# Altium schematic sheet Raspberry_Pi_Card_Connector.SchDoc
size A4
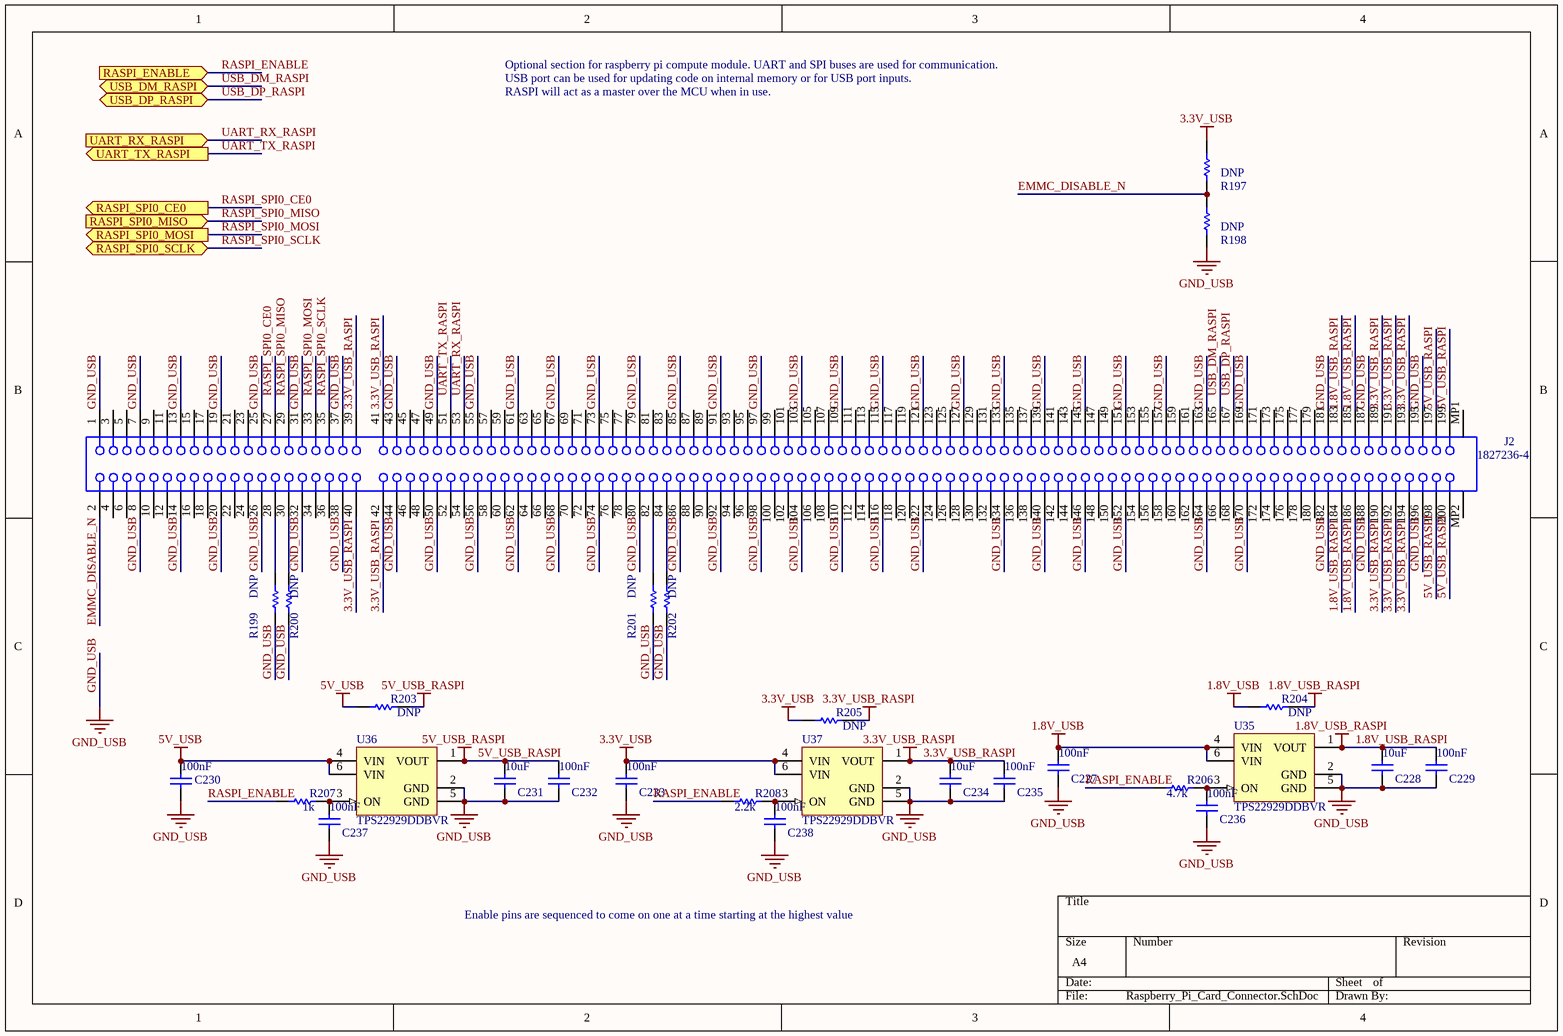
[diagram p0: Raspberry_Pi_Card_Connector.SchDoc]

## Parts
C227  value 100nF  [CAPC0402(1005)60_L]  (hidden comment: CAP0402)
C228  value 10uF  [CAPC0805(2012)145_L]  (hidden comment: CAP0805)
C229  value 100nF  [CAPC0402(1005)60_L]  (hidden comment: CAP0402)
C230  value 100nF  [CAPC0402(1005)60_L]  (hidden comment: CAP0402)
C231  value 10uF  [CAPC0805(2012)145_L]  (hidden comment: CAP0805)
C232  value 100nF  [CAPC0402(1005)60_L]  (hidden comment: CAP0402)
C233  value 100nF  [CAPC0402(1005)60_L]  (hidden comment: CAP0402)
C234  value 10uF  [CAPC0805(2012)145_L]  (hidden comment: CAP0805)
C235  value 100nF  [CAPC0402(1005)60_L]  (hidden comment: CAP0402)
C236  value 100nF  [CAPC0402(1005)60_L]  (hidden comment: CAP0402)
C237  value 100nF  [CAPC0402(1005)60_L]  (hidden comment: CAP0402)
C238  value 100nF  [CAPC0402(1005)60_L]  (hidden comment: CAP0402)
J2  1827236-4  [BTB-SM0-6-2V200]
R197  value DNP  [RESC0402(1005)_L]  (hidden comment: RES0402)
R198  value DNP  [RESC0402(1005)_L]  (hidden comment: RES0402)
R199  value DNP  [RESC0402(1005)_L]  (hidden comment: RES0402)
R200  value DNP  [RESC0402(1005)_L]  (hidden comment: RES0402)
R201  value DNP  [RESC0402(1005)_L]  (hidden comment: RES0402)
R202  value DNP  [RESC0402(1005)_L]  (hidden comment: RES0402)
R203  value DNP  [RESC0402(1005)_L]  (hidden comment: RES0402)
R204  value DNP  [RESC0402(1005)_L]  (hidden comment: RES0402)
R205  value DNP  [RESC0402(1005)_L]  (hidden comment: RES0402)
R206  value 4.7k  [RESC0402(1005)_L]  (hidden comment: RES0402)
R207  value 1k  [RESC0402(1005)_L]  (hidden comment: RES0402)
R208  value 2.2k  [RESC0402(1005)_L]  (hidden comment: RES0402)
U35  TPS22929DDBVR  [DBV6_N]
U36  TPS22929DDBVR  [DBV6_N]
U37  TPS22929DDBVR  [DBV6_N]

## Ports
RASPI_ENABLE (in), RASPI_SPI0_CE0 (out), RASPI_SPI0_MISO (in), RASPI_SPI0_MOSI (out), RASPI_SPI0_SCLK (bidir), UART_RX_RASPI (in), UART_TX_RASPI (out), USB_DM_RASPI (bidir), USB_DP_RASPI (bidir)

## Nets
1.8V_USB: C227.1 R204.2 U35.4(VIN) U35.6(VIN)
1.8V_USB_RASPI: C228.2 C229.1 J2.183 J2.184 J2.185 J2.186 R204.1 U35.1(VOUT)
3.3V_USB: C233.1 R197.1 R205.2 U37.4(VIN) U37.6(VIN)
3.3V_USB_RASPI: C234.2 C235.1 J2.39 J2.40 J2.41 J2.42 J2.189 J2.190 J2.191 J2.192 J2.193 J2.194 R205.1 U37.1(VOUT)
5V_USB: C230.1 R203.2 U36.4(VIN) U36.6(VIN)
5V_USB_RASPI: C231.2 C232.1 J2.197 J2.198 J2.199 J2.200 R203.1 U36.1(VOUT)
GND_USB: C227.2 C228.1 C229.2 C230.2 C231.1 C232.2 C233.2 C234.1 C235.2 C236.2 C237.2 C238.2 J2.1 J2.7 J2.8 J2.13 J2.14 J2.19 J2.20 J2.25 J2.26 J2.31 J2.32 J2.37 J2.38 J2.43 J2.44 J2.49 J2.50 J2.55 J2.56 J2.61 J2.62 J2.67 J2.68 J2.73 J2.74 J2.79 J2.80 J2.85 J2.86 J2.91 J2.92 J2.97 J2.98 J2.103 J2.104 J2.109 J2.110 J2.115 J2.116 J2.121 J2.122 J2.127 J2.133 J2.134 J2.139 J2.140 J2.145 J2.146 J2.151 J2.152 J2.157 J2.163 J2.164 J2.169 J2.170 J2.181 J2.182 J2.187 J2.188 J2.195 J2.196 R198.2 R199.2 R200.2 R201.2 R202.2 U35.2(GND) U35.5(GND) U36.2(GND) U36.5(GND) U37.2(GND) U37.5(GND)
EMMC_DISABLE_N: J2.2 R197.2 R198.1
RASPI_ENABLE: R206.2 R207.2 R208.2 ; port RASPI_ENABLE
RASPI_SPI0_CE0: J2.27 ; port RASPI_SPI0_CE0
RASPI_SPI0_MISO: J2.29 ; port RASPI_SPI0_MISO
RASPI_SPI0_MOSI: J2.33 ; port RASPI_SPI0_MOSI
RASPI_SPI0_SCLK: J2.35 ; port RASPI_SPI0_SCLK
UART_RX_RASPI: J2.53 ; port UART_RX_RASPI
UART_TX_RASPI: J2.51 ; port UART_TX_RASPI
USB_DM_RASPI: J2.165 ; port USB_DM_RASPI
USB_DP_RASPI: J2.167 ; port USB_DP_RASPI
NetC236_1: C236.1 R206.1 U35.3(ON)
NetC237_1: C237.1 R207.1 U36.3(ON)
NetC238_1: C238.1 R208.1 U37.3(ON)
NetJ2_28: J2.28 R199.1
NetJ2_30: J2.30 R200.1
NetJ2_82: J2.82 R202.1
NetJ2_84: J2.84 R201.1

Not connected (* = marked no-connect by the designer): J2 3 4 5 6 9 10 11 12 15 16 17 18 21 22 23 24 34 36 45 46 47 48 52 54 57 58 59 60 63 64 65 66 69 70 71 72 75 76 77 78 81 83 87 88 89 90 93 94 95 96 99 100 101 102 105 106 107 108 111 112 113 114 117 118 119 120 123 124 125 126 128 129 130 131 132 135 136 137 138 141 142 143 144 147 148 149 150 153 154 155 156 158 159 160 161 162 166 168 171 172 173 174 175 176 177 178 179 180 MP1 MP2

## Notes on the sheet
- Optional section for raspberry pi compute module. UART and SPI buses are used for communication.
- USB port can be used for updating code on internal memory or for USB port inputs.
- RASPI will act as a master over the MCU when in use.
- Enable pins are sequenced to come on one at a time starting at the highest value

## Library data of the parts
C227 C229 C230 C232 C233 C235-C238 = CMP-1590-00004-1: 0402 (1005 Metric) Chip Capacitor; Case-EIA: 0402; Case-Metric: 1005; PackageReference: CAPC0402(1005)60
C228 C231 C234 = CMP-1590-00003-1: 0805 (2012 Metric) Chip Capacitor; Case-EIA: 0805; Case-Metric: 2012; PackageReference: CAPC0805(2012)145
J2 = CMP-0001-00111-2: Board-to-Board Connector, SMT, Right Angle, Pitch 0.6mm, Voltage Key 1.8V, 200-Position; Mating Connector: SODIMM-CN-2P-M-R200; Package Reference: BTB-SM0-6-2V200; ClassName: Board Template Connector; Datasheet Version: Jun-2003; Publisher: Altium; Component Kind: Standard
R197-R208 = CMP-1591-00004-1: 0402 (1005 Metric) Chip Resistor; Case-EIA: 0402; Case-Metric: 1005; PackageReference: RESC0402(1005)
U35-U37 = CMP-0330-00011-1: Low Input Voltage, 1.8 A Single Channel Load Switch with Controlled Turn-On, 1.8 V Logic Compatible, 1.8 A, 1.4 to 5.5 V, -40 to 85 degC, 6-pin SOT-23 (DBV), Green (RoHS & no Sb/Br); Manufacturer: Texas Instruments; Quick Output Discharge Transistor: Yes; SubFamily: Non Current Limited Load Switch; Iin(nA): 10000; Control Logic: 1.8-V Logic Compatible; HBM ESD(kV): 2; Vin(V): 1.4 - 5.5; Active High Enable: TRUE; Output Rise Time(ÂµS): 4500; Imax(A): 1.8; rON @1.8V(mOhm): 85; PartNumber: TPS22929DDBVR; Eco-Plan: Green (RoHS & no Sb/Br); ComponentLink1Description: Datasheet; DatasheetVersion: SLVSB39; PackageReference: DBV6; PackageVersion: revK, Mar-2006; PackageDescription: 6-Pin Plastic Small-Outline Package, 2.9 x 1.6 mm Body, 0.95 mm Pitch, 2.8 mm Lead Span; ComponentLink1URL: http://www.ti.com/general/docs/lit/getliterature.tsp?genericPartNumber=TPS22929D&fileType=pdf; Code_JEDEC: MO-178-AB*; Mounting Technology: Surface Mount